# EAGLE design 1.IOT_ON_OFF_220V_LDR (EAGLE 7.1.0)
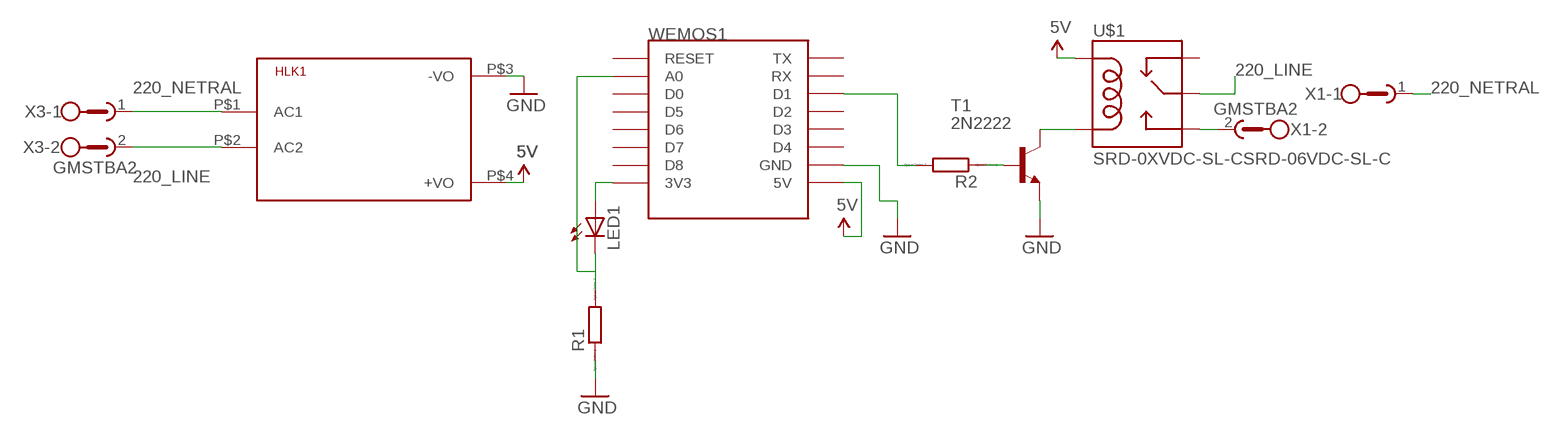
[diagram p0: schematic, sheet 1]

## Parts
HLK1  HLK-PM013W  [HLK-PM01]
LED1  LED5MM  [LED5MM]
R1  R-EU_0207_10  [0207/10]
R2  R-EU_0207_10  [0207/10]
T1  2N2222  [TO18]
U$1  SRD-0XVDC-SL-CSRD-06VDC-SL-C  [SRD-0XVDC-SL-C]
WEMOS1  WEMOS-D1-MINI  [WEMOS-D1-MINI]
X1  GMSTBA2  [GMSTBA2]
X3  GMSTBA2  [GMSTBA2]

## Nets
5V: HLK1.P$4(+VO) U$1.COIL1 WEMOS1.5V
220_LINE: HLK1.P$2(AC2) U$1.SWCOMMON X3.2
220_NETRAL: HLK1.P$1(AC1) X1.1 X3.1
GND: HLK1.P$3(-VO) R1.1 T1.1(E) WEMOS1.GND
N$1: U$1.SWOPEN X1.2
N$2: R2.2 WEMOS1.D1
N$3: T1.3(C) U$1.COIL0
N$4: LED1.A WEMOS1.3V3
N$5: LED1.K(C) R1.2 WEMOS1.A0
N$6: R2.1 T1.2(B)
Unconnected: U$1.SWCLOSED(SWCLOSE) WEMOS1.D0 WEMOS1.D2 WEMOS1.D3 WEMOS1.D4 WEMOS1.D5 WEMOS1.D6 WEMOS1.D7 WEMOS1.D8 WEMOS1.RESET WEMOS1.RX WEMOS1.TX

## Library data of the parts
HLK1 = HLK-PM01:HLK-PM01: Hi-Link Power Supply HLK-PM01 3W Author: Ahmed Said <https://github.com/AhmedSaid/EAGLELibraries>
LED1 = led:LED: LED OSRAM: - CHIPLED LG R971, LG N971, LY N971, LG Q971, LY Q971, LO R971, LY R971 LH N974, LH R974 LS Q976, LO Q976, LY Q976 LO Q996 - Hyper CHIPLED LW Q18S LB Q993, LB Q99A, LB R99A - SideLED LS A670, LO A670, LY A670, LG A670, LP A670 LB A673, LV A673, LT A673, LW A673 LH A674 LY A675 LS A676, LA A676, LO A676, LY A676, LW A676 LS A679, LY A679, LG A679 - Hyper Micro SIDELED® LS Y876, LA Y876, LO Y876, LY Y876 LT Y87S - SmartLED LW L88C, LW L88S LB L89C, LB L89S, LG L890 LS L89K, LO L89K, LY L89K LS L896, LA L896, LO L896, LY L896 - TOPLED LS T670, LO T670, LY T670, LG T670, LP T670 LSG T670, LSP T670, LSY T670, LOP T670, LYG T670 LG T671, LOG T671, LSG T671 LB T673, LV T673, LT T673, LW T673 LH T674 LS T676, LA T676, LO T676, LY T676, LB T676, LH T676, LSB T676, LW T676 LB T67C, LV T67C, LT T67C, LS T67K, LO T67K, LY T67K, LW E67C LS E67B, LA E67B, LO E67B, LY E67B, LB E67C, LV E67C, LT E67C LW T67C LS T679, LY T679, LG T679 LS T770, LO T770, LY T770, LG T770, LP T770 LB T773, LV T773, LT T773, LW T773 LH T774 LS E675, LA E675, LY E675, LS T675 LS T776, LA T776, LO T776, LY T776, LB T776 LHGB T686 LT T68C, LB T68C - Hyper Mini TOPLED® LB M676 - Mini TOPLED Santana® LG M470 LS M47K, LO M47K, LY M47K Source: http://www.osram.convergy.de LUXEON: - LUMILED® LXK2-PW12-R00, LXK2-PW12-S00, LXK2-PW14-U00, LXK2-PW14-V00 LXK2-PM12-R00, LXK2-PM12-S00, LXK2-PM14-U00 LXK2-PE12-Q00, LXK2-PE12-R00, LXK2-PE12-S00, LXK2-PE14-T00, LXK2-PE14-U00 LXK2-PB12-K00, LXK2-PB12-L00, LXK2-PB12-M00, LXK2-PB14-N00, LXK2-PB14-P00, LXK2-PB14-Q00 LXK2-PR12-L00, LXK2-PR12-M00, LXK2-PR14-Q00, LXK2-PR14-R00 LXK2-PD12-Q00, LXK2-PD12-R00, LXK2-PD12-S00 LXK2-PH12-R00, LXK2-PH12-S00 LXK2-PL12-P00, LXK2-PL12-Q00, LXK2-PL12-R00 Source: www.luxeon.com KINGBRIGHT: KA-3528ASYC Source: www.kingbright.com
R1 R2 = resistor:R-EU_: RESISTOR, European symbol; SPICEPREFIX: R
T1 = transistor:2N2222: NPN TRANSISTOR
U$1 = SRD-0XVDC-SL-C:SRD-0XVDC-SL-C: SRD-05VDC-SL-C SRD-06VDC-SL-C Compatible with: SONGLE Relays SHUN YU JQX-3F other same relays Author: Ahmed Said <https://github.com/AhmedSaid/EAGLELibraries>
WEMOS1 = esp8266modules:WEMOS-D1-MINI: WeMos.cc D1 mini ESP8266 module
X1 X3 = con-phoenix-762:GMSTBA2: PHOENIX; MF: FARNELL; MPN: 1757242; OC_FARNELL: 3705171; OC_NEWARK: 71C4161

## Board
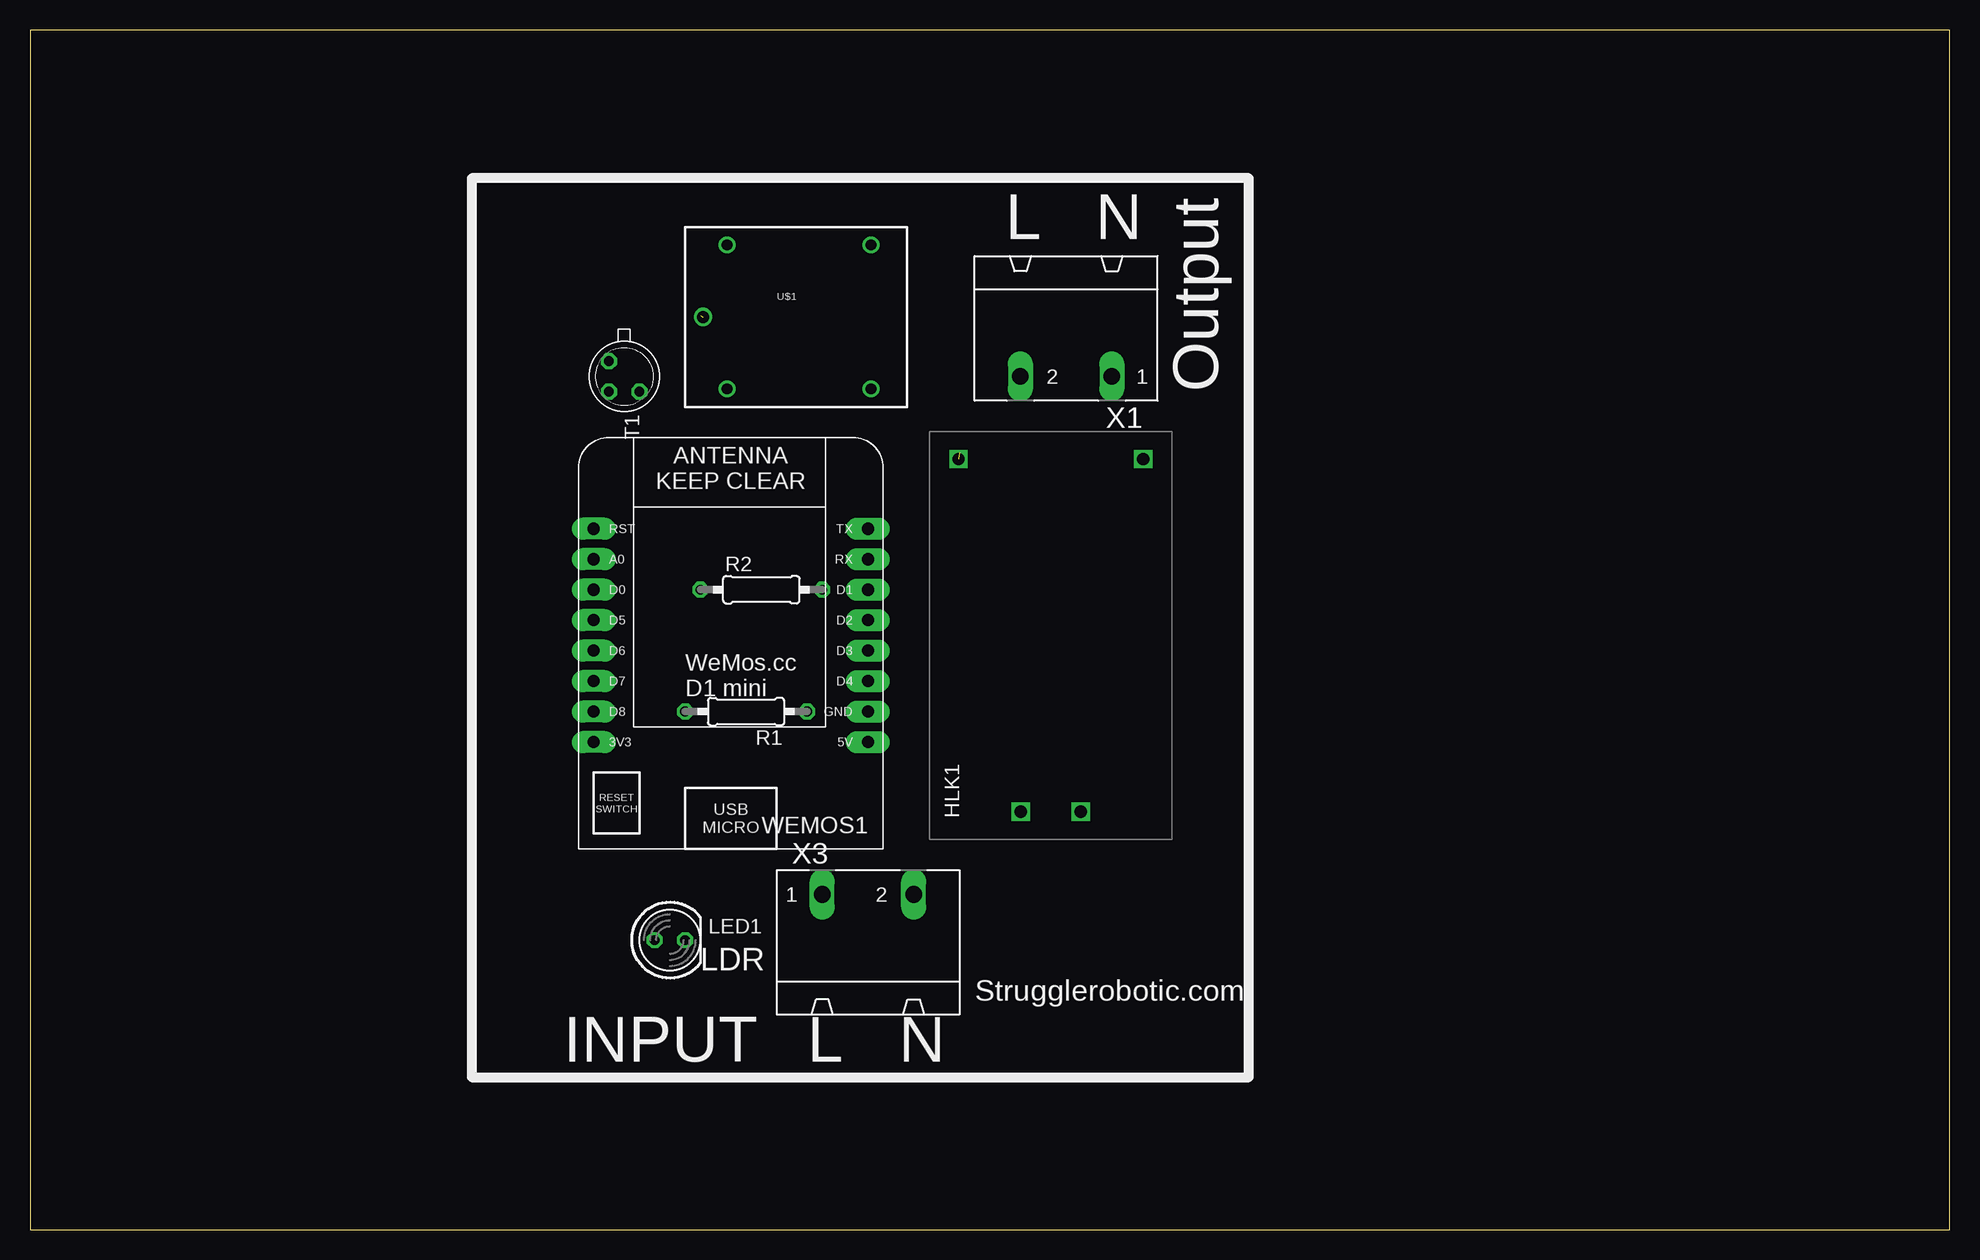
[diagram p1: board, top side]
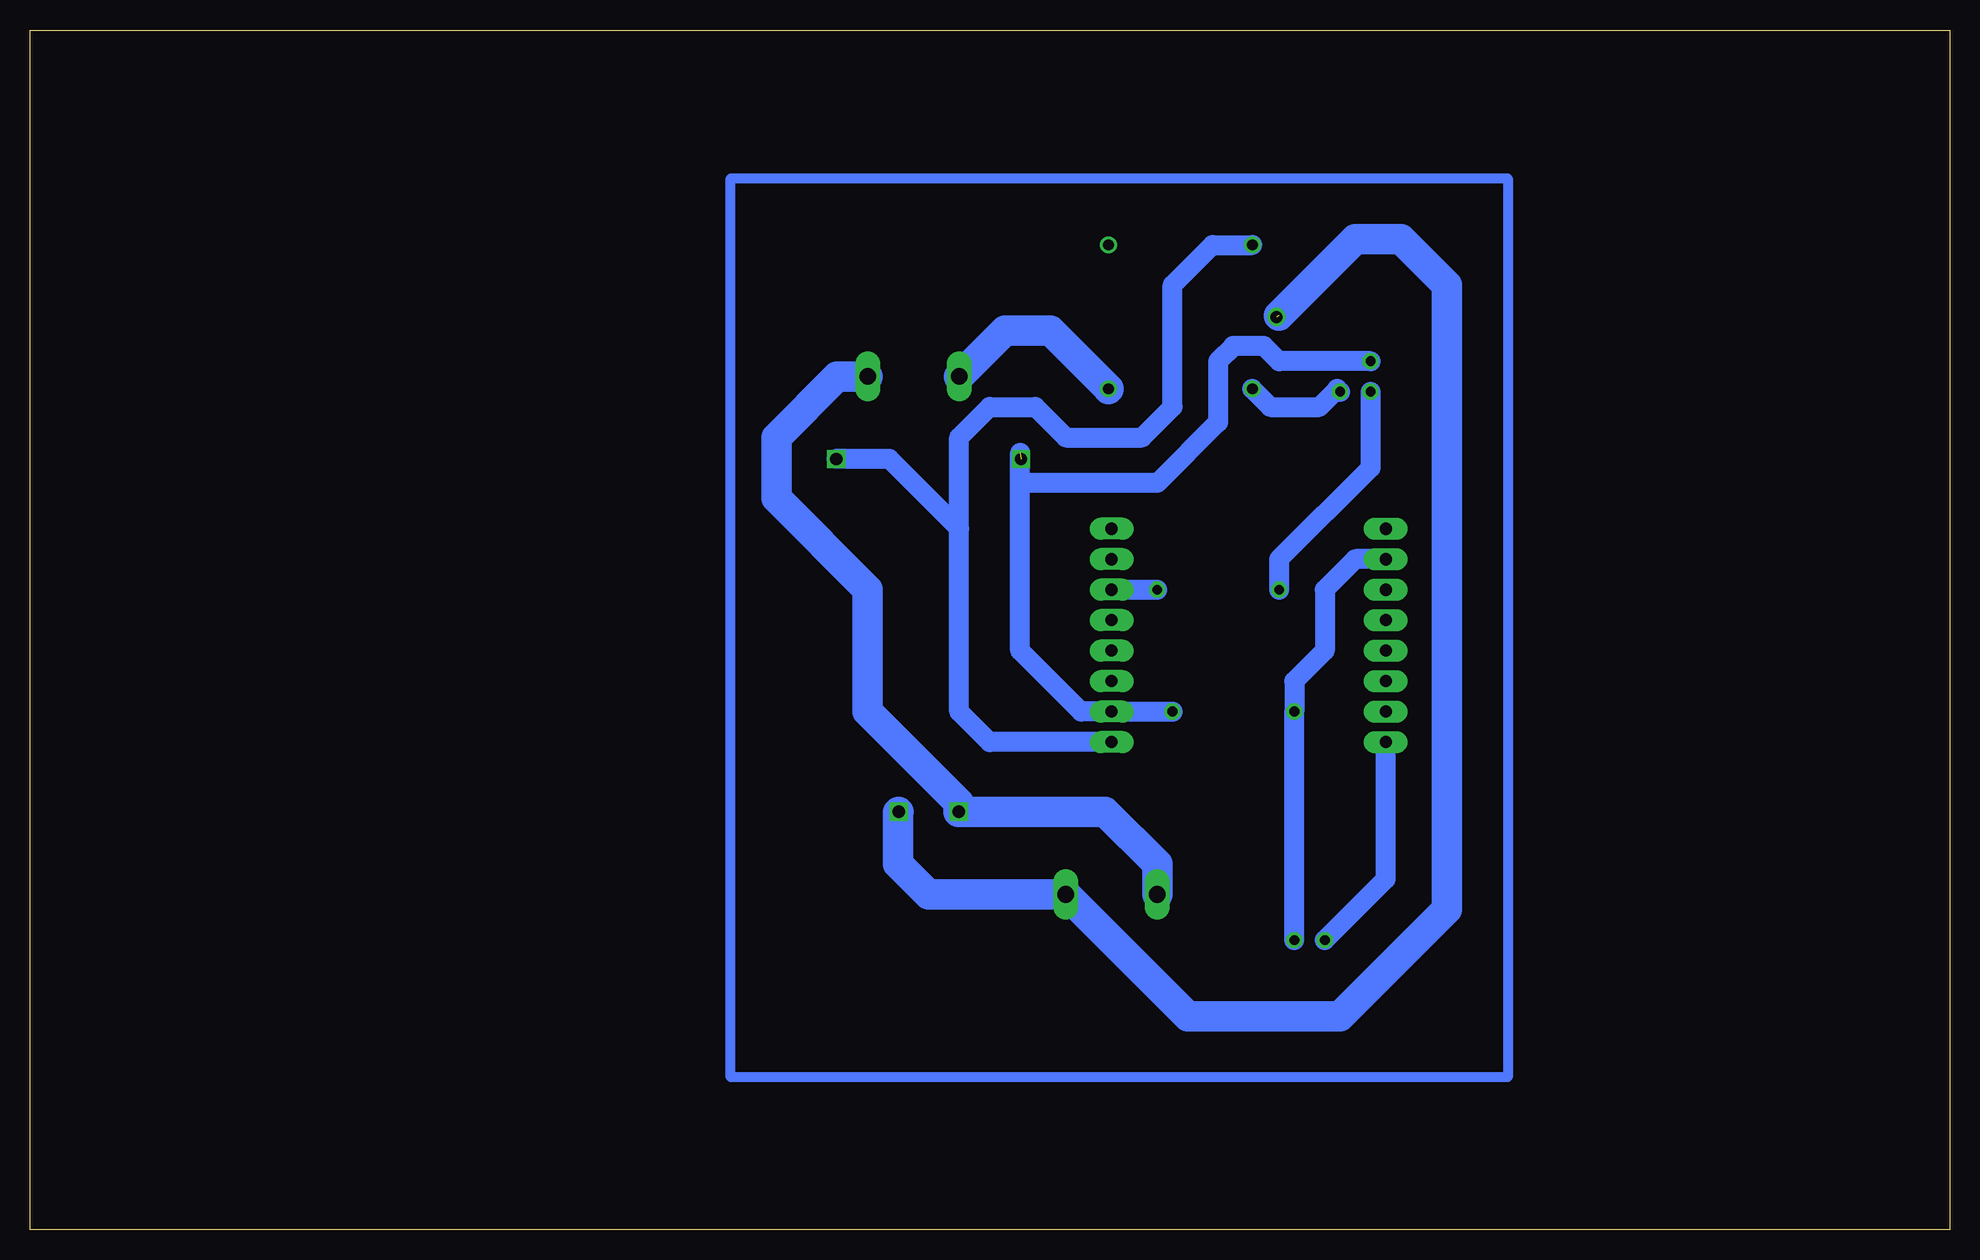
[diagram p2: board, bottom side, seen from below]

Size 160 x 100 mm. Coordinates in mm from the lower left corner, seen from the top.
Outline: 0,0 160,0 160,100 0,100 0,0
Copper layers (1*16): Top 0.035mm / dielectric 1.5mm / Bottom 0.035mm
Design rules "default": minimum track width 10mil, minimum drill 24mil, track to track 8mil, track to pad 8mil, pad to pad 8mil, via to via 8mil, smd to smd 8mil, copper to edge 40mil, drill to drill 8mil, minimum pad ring 10mil, minimum via ring 8mil, stop-mask expansion 4mil, vias tented up to drill 0mil, thermal gap 10mil

### Footprints (pad centres in the part's own frame; a part is rotated, then mirrored left to right if it is on the bottom)
HLK-PM01 = drill 1.016 square: P$1 -14.7,2.5; P$2 -14.7,-2.5; P$3 14.7,7.7; P$4 14.7,-7.7
LED5MM = drill 0.813 octagon: A -1.27,0; K 1.27,0
0207/10 = drill 0.813 octagon: 1 -5.08,0; 2 5.08,0
TO18 = drill 0.813 octagon: 1 -1.27,-1.27; 2 1.27,-1.27; 3 1.27,1.27
SRD-0XVDC-SL-C = drill 0.9: COIL0 -5.39,-6.12; COIL1 -5.39,5.88; SWCLOSED 6.61,5.88; SWOPEN 6.61,-6.12 | drill 1: SWCOMMON -7.39,-0.12
WEMOS-D1-MINI = drill 1.016 pad 1.829 long: 3V3 -10.16,-10.16; 5V 12.7,-10.16; A0 -10.16,5.08; D0 -10.16,2.54; D1 12.7,2.54; D2 12.7,0; D3 12.7,-2.54; D4 12.7,-5.08; D5 -10.16,0; D6 -10.16,-2.54; D7 -10.16,-5.08; D8 -10.16,-7.62; GND 12.7,-7.62; RESET -10.16,7.62; RX 12.7,5.08; TX 12.7,7.62
GMSTBA2 = drill 1.397 long: 1 -3.81,5.08; 2 3.81,5.08

### Placement (x,y rotation side)
HLK1  85.09,49.53 90 top
LED1  53.34,24.13 0 top
R1  59.69,43.18 180 top
R2  60.96,53.34 0 top
T1  49.53,71.12 270 top
U$1  63.5,76.2 0 top
WEMOS1  57.15,50.8 0 top
X1  86.36,76.2 180 top
X3  69.85,22.86 0 top

### Tracks (layer width: path | path; a pad name or v marks a point on that pad's centre or on a via)
5V
  Bottom 1.676: WEMOS1.5V 80.01,40.64 82.55,43.18 82.55,58.42 | 82.55,58.42 88.36,64.23 HLK1.P$4 | 82.55,58.42 82.55,66.04 80.01,68.58 76.2,68.58 73.66,66.04 67.31,66.04 64.77,68.58 64.77,78.74 61.43,82.08 U$1.COIL1
220_LINE  (1 unrouted)
  Bottom 2.54: HLK1.P$2 87.63,34.79 87.63,30.48 85.09,27.94 X3.2 63.5,17.78 50.8,17.78 41.91,26.67 41.91,78.74 45.72,82.55 49.53,82.55 55.88,76.2
220_NETRAL
  Bottom 2.54: X3.1 66.04,30.48 70.39,34.83 HLK1.P$1 82.59,35.6 90.17,43.18 90.17,53.34 97.79,60.96 97.79,66.04 92.71,71.12 X1.1
GND  (1 unrouted)
  Bottom 1.676: R1.1 WEMOS1.GND 72.39,43.18 77.47,48.26 77.47,62.23 | T1.1 55.88,72.39 57.15,73.66 59.69,73.66 60.96,72.39 60.96,67.31 66.04,62.23 77.47,62.23 | 77.47,62.23 77.47,64.77
N$1
  Bottom 2.54: X1.2 78.74,74.93 74.93,74.93 70.11,70.11 U$1.SWOPEN
N$2
  Bottom 1.676: WEMOS1.D1 R2.2
N$3
  Bottom 1.676: T1.3 51.03,70.08 52.53,68.58 56.61,68.58 U$1.COIL0
N$4
  Bottom 1.676: LED1.A 46.99,29.21 WEMOS1.3V3
N$5
  Bottom 1.676: LED1.K R1.2 54.61,45.72 52.07,48.26 52.07,53.34 49.53,55.88 WEMOS1.A0
N$6
  Bottom 1.676: T1.2 48.26,63.5 55.88,55.88 R2.1
N$7
  Bottom 0.813: 36.83,12.7 101.6,12.7 101.6,87.63 36.83,87.63 36.83,12.7

### Text on the board
tPlace: N | L | Output | LDR | Strugglerobotic.com | INPUT | L | N